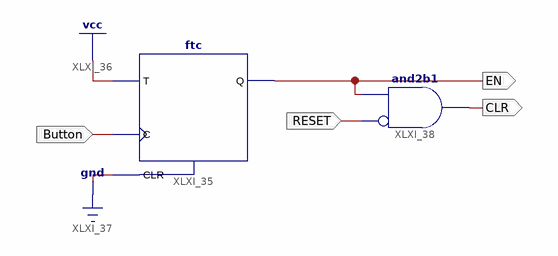
[diagram p0: schematic sheet 1]
// Xilinx ISE schematic WatchControl.sch (spartan6) as structural Verilog: 2 symbols, 4 ports
module WatchControl (
  input  RESET,
  input  Button,
  output EN,
  output CLR
);

  ftc XLXI_35 (.C(Button), .CLR(1'b0), .T(1'b1), .Q(EN));
  and XLXI_38 (CLR, ~RESET, EN);  // and2b1
endmodule
